# EAGLE design Reflowduino Pro v3 (EAGLE 8.4.3)
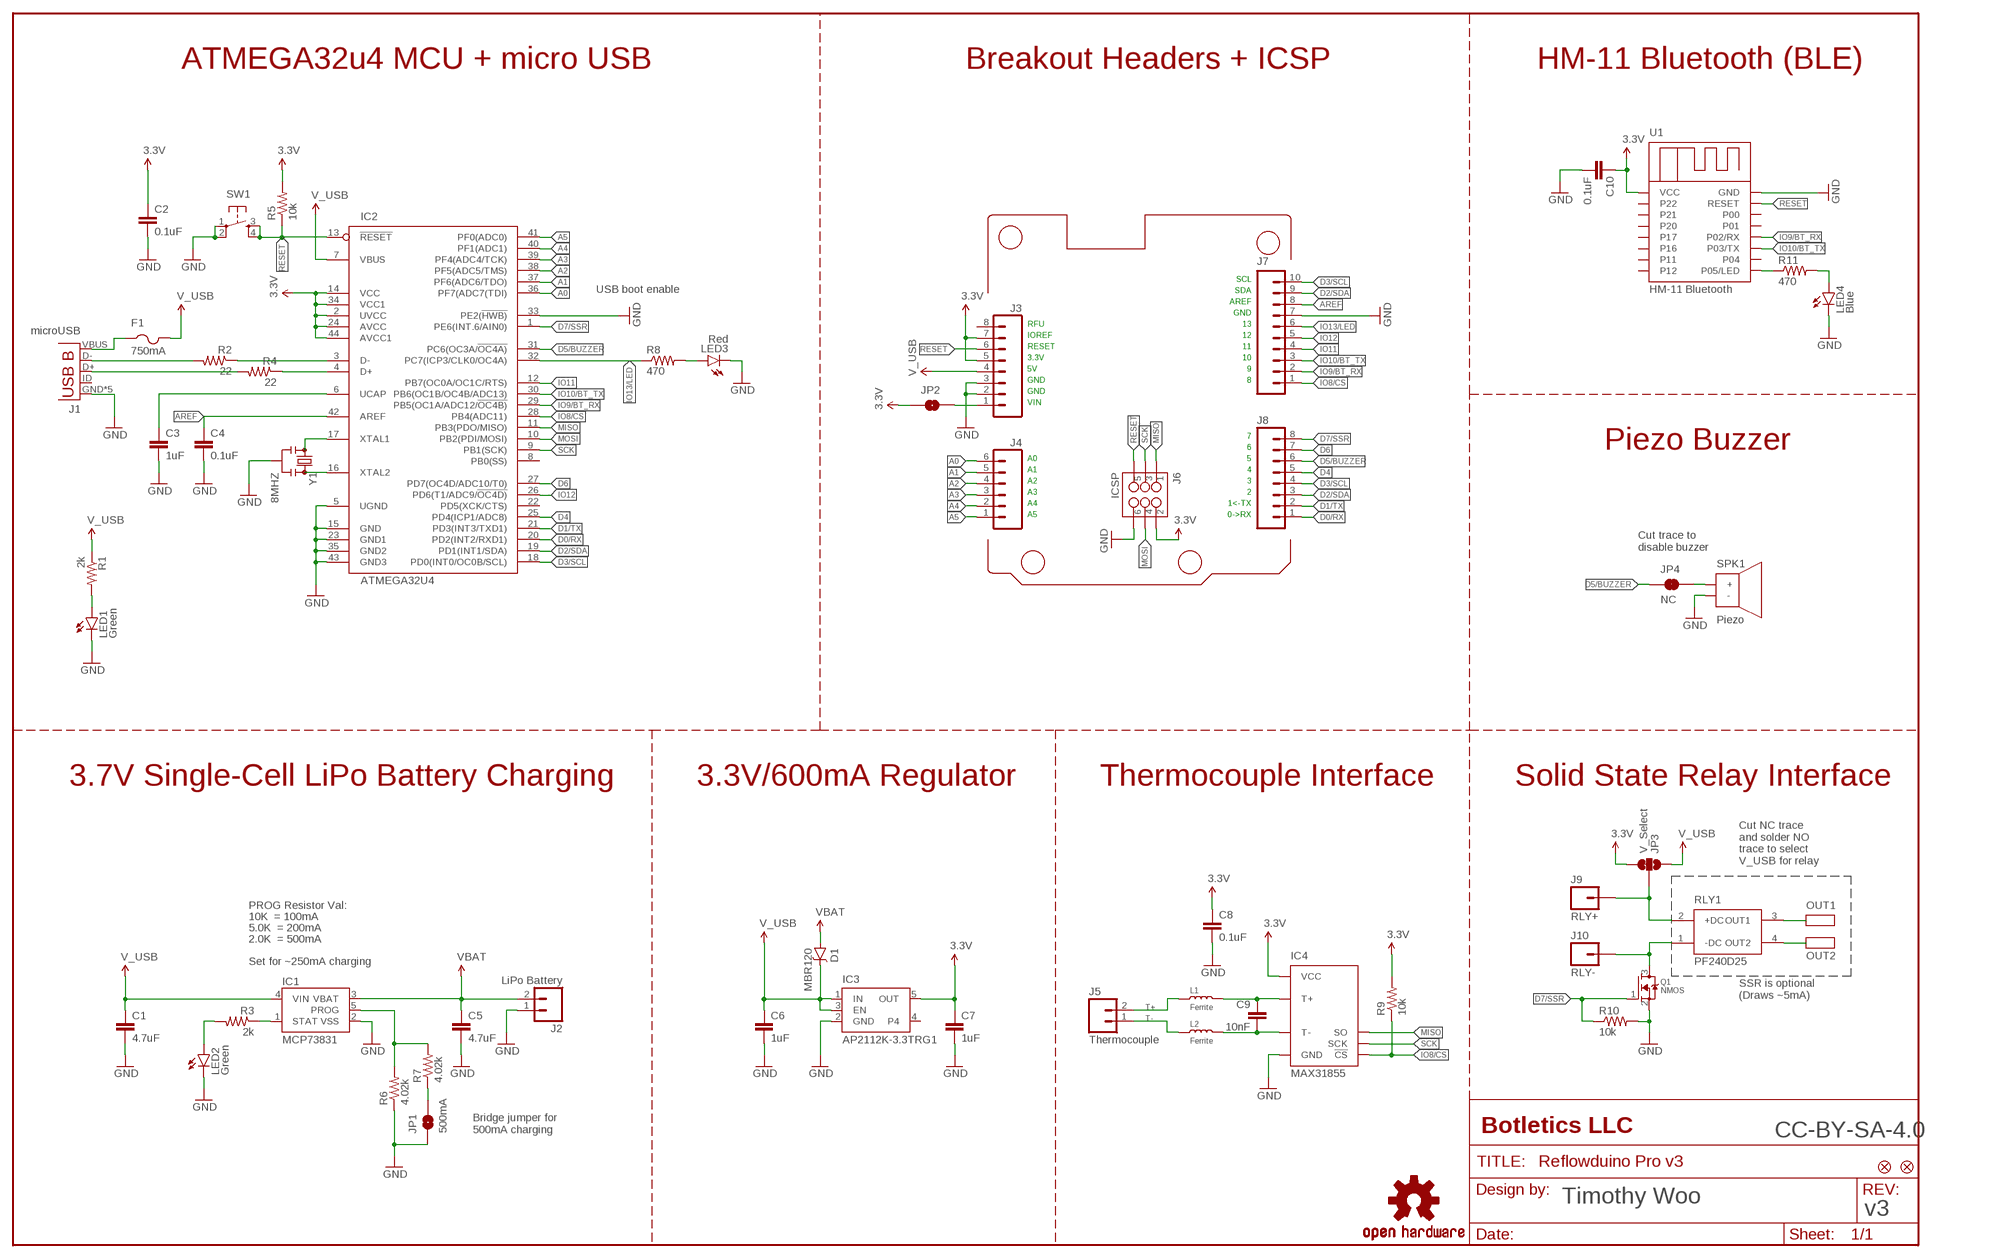
[diagram p0: schematic, sheet 1]

## Parts
C1  4.7uF  CAPMARKED-0603  [0603-CAP-MARKED]
C2  0.1uF  CAPMARKED-0603  [0603-CAP-MARKED]
C3  1uF  CAPMARKED-0603  [0603-CAP-MARKED]
C4  0.1uF  CAPMARKED-0603  [0603-CAP-MARKED]
C5  4.7uF  CAPMARKED-0603  [0603-CAP-MARKED]
C6  1uF  CAPMARKED-0603  [0603-CAP-MARKED]
C7  1uF  CAPMARKED-0603  [0603-CAP-MARKED]
C8  0.1uF  CAPMARKED-0603  [0603-CAP-MARKED]
C9  10nF  CAPMARKED-0603  [0603-CAP-MARKED]
C10  0.1uF  CAPMARKED-0603  [0603-CAP-MARKED]
D1  MBR120  DIODE-SCHOTTKYSOD-123FL  [SOD-123FL]
F1  750mA  PTCFUSE-0ZCH0075FF2G  [1210]
FID1  FIDUCIAL  [FIDUCIAL_1MM]
FID2  FIDUCIAL  [FIDUCIAL_1MM]
IC1  MCP73831  [SOT23-5]
IC2  ATMEGA32U4  ATMEGA32U4-AU  [TQFP44]
IC3  AP2112K-3.3TRG1  VOLTAGE-REGULATOR_SOT23-5SOT-23-5  [SOT23-5]
IC4  MAX31855  [MAX31855_SOIC8]
J1  microUSB  MICRO-USB_SMD_NOSHIELDV1  [USB-B-MICRO-SMD]
J2  LiPo Battery  M02-JST-2MM-SMT  [JST-2-SMD]
J3  M08SILK_PTH  [1X08]
J4  M06SILK_PTH  [1X06]
J5  Thermocouple  M023.5MM  [SCREWTERMINAL-3.5MM-2]
J6  ICSP  M03X22X3_SILK_MALE_PTH  [2X3]
J7  M10SILK_PTH  [1X10]
J8  M08SILK_PTH  [1X08]
J9  RLY+  M01PTH_LONGPAD  [1X01_LONGPAD]
J10  RLY-  M01PTH_LONGPAD  [1X01_LONGPAD]
JP1  500mA  JUMPER-SMT_2_NO_SILK  [SMT-JUMPER_2_NO_SILK]
JP2  JUMPER-SMT_2_NO_SILK  [SMT-JUMPER_2_NO_SILK]
JP3  V_Select  JUMPER-SMT_3_1-NC_TRACE_SILK  [SMT-JUMPER_3_1-NC_TRACE_SILK]
JP4  NC  JUMPER-SMT_2_NC_TRACE_SILK  [SMT-JUMPER_2_NC_TRACE_SILK]
L1  Ferrite  SMD-FERRITE-BEAD-2500R-50MA(0603)  [L0603]
L2  Ferrite  SMD-FERRITE-BEAD-2500R-50MA(0603)  [L0603]
LED1  Green  LED0603-MARKED  [LED-0603-MARKED]
LED2  Green  LED0603-MARKED  [LED-0603-MARKED]
LED3  Red  LED0603-MARKED  [LED-0603-MARKED]
LED4  Blue  LED0603-MARKED  [LED-0603-MARKED]
LOGO1  OSHW-LOGOL  [OSHW-LOGO-L]
Q1  NMOS  MOSFET-NGENERIC  [SOT23-3]
R1  2k  RESISTORMARKED-0603  [0603-RES-MARKED]
R2  22  RESISTORMARKED-0603  [0603-RES-MARKED]
R3  2k  RESISTORMARKED-0603  [0603-RES-MARKED]
R4  22  RESISTORMARKED-0603  [0603-RES-MARKED]
R5  10k  RESISTORMARKED-0603  [0603-RES-MARKED]
R6  4.02k  RESISTORMARKED-0603  [0603-RES-MARKED]
R7  4.02k  RESISTORMARKED-0603  [0603-RES-MARKED]
R8  470  RESISTORMARKED-0603  [0603-RES-MARKED]
R9  10k  RESISTORMARKED-0603  [0603-RES-MARKED]
R10  10k  RESISTORMARKED-0603  [0603-RES-MARKED]
R11  470  RESISTORMARKED-0603  [0603-RES-MARKED]
RLY1  PF240D25  RELAY_SSR_OPTO-ISOLATEDPF240  [RELAY_PF240]
SPK1  Piezo  BUZZERPKMCS0909E4000  [BUZZER_PKMCS0909E4000]
SW1  SWITCH_MOMENTARY_SPST_4-PINRECT  [TACTILE_SWITCH_SMD_4.6X2.8MM]
U1  HM-11 Bluetooth  HM-11_JDY-08_BLUETOOTH  [JDY-08_BLUETOOTH]
Y1  8MHZ  RESONATOR8MHZ  [CSTCE_RESONATOR_SMD]

## Nets
3.3V: C2.1 C7.1 C8.1 C10.1 IC2.2(UVCC) IC2.14(VCC) IC2.24(AVCC) IC2.34(VCC1) IC2.44(AVCC1) IC3.5(OUT) IC4.4(VCC) J3.5 J3.7 J6.2 JP2.1 JP3.3 R5.2 R9.2 U1.1(VCC)
A0: IC2.36(PF7(ADC7(TDI)) J4.6
A1: IC2.37(PF6(ADC6/TDO)) J4.5
A2: IC2.38(PF5(ADC5/TMS)) J4.4
A3: IC2.39(PF4(ADC4/TCK)) J4.3
A4: IC2.40(PF1(ADC1)) J4.2
A5: IC2.41(PF0(ADC0)) J4.1
AREF: C4.1 IC2.42(AREF) J7.8
D0/RX: IC2.20(PD2(INT2/RXD1)) J8.1
D1/TX: IC2.21(PD3(INT3/TXD1)) J8.2
D2/SDA: IC2.19(PD1(INT1/SDA)) J7.9 J8.3
D3/SCL: IC2.18(PD0(INT0/OC0B/SCL)) J7.10 J8.4
D4: IC2.25(PD4(ICP1/ADC8)) J8.5
D5/BUZZER: IC2.31(PC6(OC3A/!OC4A)) J8.6 JP4.1
D6: IC2.27(PD7(OC4D/ADC10/T0)) J8.7
D7/SSR: IC2.1(PE6(INT.6/AIN0)) J8.8 Q1.1(G) R10.1
D+: IC2.4(D+) R4.1
D-: IC2.3(D-) R2.1
DC+: J9.1 JP3.2 RLY1.2(+DC)
DC-: J10.1 Q1.3(D) RLY1.1(-DC)
GND [power]: C1.2 C2.2 C3.2 C4.2 C5.2 C6.2 C7.2 C8.2 C10.2 IC1.2(VSS) IC2.5(UGND) IC2.15(GND) IC2.23(GND1) IC2.33(PE2(!HWB)) IC2.35(GND2) IC2.43(GND3) IC3.2(GND) IC4.1(GND) J1.GND J1.SHIELD1(GND) J1.SHIELD2(GND) J1.SHIELD3(GND) J1.SHIELD4(GND) J2.1 J3.2 J3.3 J6.6 J7.7 JP1.1 LED1.C LED2.C LED3.C LED4.C Q1.2(S) R6.1 R10.2 SPK1.2(-) SW1.1 SW1.2 U1.16(GND) Y1.2
IO8/CS: IC2.28(PB4(ADC11)) IC4.6(!CS) J7.1 R9.1
IO9/BT_RX: IC2.29(PB5(OC1A/ADC12/!OC4B)) J7.2 U1.12(P02/RX)
IO10/BT_TX: IC2.30(PB6(OC1B/OC4B/ADC13)) J7.3 U1.11(P03/TX)
IO11: IC2.12(PB7(OC0A/OC1C/RTS)) J7.4
IO12: IC2.26(PD6(T1/ADC9/!OC4D)) J7.5
IO13/LED: IC2.32(PC7(ICP3/CLK0/OC4A)) J7.6 R8.1
LED: R11.1 U1.9(P05/LED)
MISO: IC2.11(PB3(PDO/MISO)) IC4.7(SO) J6.1
MOSI: IC2.10(PB2(PDI/MOSI)) J6.4
N$1: IC2.17(XTAL1) Y1.1
N$2: J1.D- R2.2
N$3: J1.D+ R4.2
N$5: JP4.2 SPK1.1(+)
N$6: LED2.A R3.2
N$7: C9.2 IC4.2(T-) L2.2
N$8: C9.1 IC4.3(T+) L1.2
N$9: LED1.A R1.2
N$10: IC2.16(XTAL2) Y1.3
N$11: LED4.A R11.2
N$12: JP1.2 R7.1
N$13: J3.1 JP2.2
N$31: LED3.A R8.2
OUT1: RLY1.3(OUT1)
OUT2: RLY1.4(OUT2)
PROG: IC1.5(PROG) R6.2 R7.2
RESET: IC2.13(!RESET) J3.6 J6.5 R5.1 SW1.3 SW1.4 U1.15(RESET)
SCK: IC2.9(PB1(SCK)) IC4.5(SCK) J6.3
STAT: IC1.1(STAT) R3.1
T+: J5.2 L1.1
T-: J5.1 L2.1
UCAP: C3.1 IC2.6(UCAP)
V_USB [power]: C1.1 C6.1 D1.C F1.2 IC1.4(VIN) IC2.7(VBUS) IC3.1(IN) IC3.3(EN) J3.4 JP3.1 R1.1
VBAT [power]: C5.1 D1.A IC1.3(VBAT) J2.2
XUSB: F1.1 J1.VBUS
Unconnected: IC2.8(PB0(SS)) IC2.22(PD5(XCK/CTS)) IC3.4 J1.ID(USBID) J3.8 U1.2(P22) U1.3(P21) U1.4(P20) U1.5(P17) U1.6(P16) U1.7(P11) U1.8(P12) U1.10(P04) U1.13(P01) U1.14(P00)

## Notes on the sheet
- ATMEGA32u4 MCU + micro USB | Breakout Headers + ICSP | HM-11 Bluetooth (BLE)
- SCL
- USB boot enable | SDA
- AREF
- GND
- RFU | 13
- IOREF | 12
- RESET | 11
- 3.3V | 10
- 5V | 9
- GND | 8
- GND
- VIN
- 7
- 6 | Piezo Buzzer
- A0 | 5
- A1 | 4
- A2 | 3
- A3 | 2
- A4 | 1<-TX
- A5 | 0->RX
- Cut trace to
  disable buzzer
- 3.7V Single-Cell LiPo Battery Charging | 3.3V/600mA Regulator | Thermocouple Interface | Solid State Relay Interface
- Cut NC trace
  and solder NO
  trace to select
  V_USB for relay
- PROG Resistor Val: | OUT1
- 10K  = 100mA
- 5.0K  = 200mA
- 2.0K  = 500mA
- OUT2
- Set for ~250mA charging
- SSR is optional
  (Draws ~5mA)
- Bridge jumper for
  500mA charging
- CC-BY-SA-4.0
- Timothy Woo
- v3

## Library data of the parts
C1-C10 = TimWoo-Capacitors:CAP: Capacitor Standard 0603 ceramic capacitor, and 0.1" leaded capacitor.
D1 = TimWoo-Diodes:DIODE-SCHOTTKY: Schottky diodes in SFE's production catalog BAT20J 1A 23V 0.62Vf RB751 120mA 40V 0.37Vf PMEG4005EJ 0.5A 40V 0.42Vf MBRA140 1A 40V 0.5Vf B340A 3A 40V SMA
F1 = TimWoo-PTC_Fuses:PTCFUSE: PTC fuses, resettable thermistors
FID1 FID2 = TimWoo-Aesthetics:FIDUCIAL: Fiducial Alignment Points Various fiducial points for machine vision alignment.
IC1 = TimWoo-IC:MCP73831: Miniature single cell, fully integrated Li-Ion, Li-polymer charge management controller http://ww1.microchip.com/downloads/en/DeviceDoc/20001984g.pdf IC-09995; PROD_ID: IC-09995
IC2 = TimWoo-IC:ATMEGA32U4: http://www.ladyada.net/library/eagle
IC3 = TimWoo-IC:VOLTAGE-REGULATOR_SOT23-5: SOT23-5 Fixed Voltage Regulators To better organise some of the SOT23-5 fixed voltage regulators in this library, this new part was created. Part Current Out V Out V In V Dropout Digikey Part No. ADP121 150mA 3.3V 3.4-5.5V 0.09V @ 150mA ADP121-AUJZ33R7CT-ND ADP121 150mA 3.0V 3.1-5.5V 0.09V @ 150mA ADP121-AUJZ30R7CT-ND ADP122 300mA 3.3V 3.4-5.5V 0.085V @ 300mA ADP122AUJZ-3.3-R7CT-ND ADP1712 300mA 3.3V 3.5-5.5V 0.17V @ 300mA ADP1712AUJZ-3.3-R7TR-ND AP7311 (Low Cost) 150mA 3.3V 3.5-6V 0.15V @ 150mA AP7311-33WG-7DICT-ND LD39015M18R 150mA 1.8V 1.9V-5.5V 0.08V @ 100mA 497-6977-1-ND MCP1824T-3302E/OT 300mA 3.3V 3.5V-6V 0.2V @ 300mA MCP1824T-3302E/OTCT-ND MIC5205-2.5YM5 TR 150mA 2.5V 2.7-16V 0.165V @ 150mA 576-1257-2-ND MIC5205-3.0YM5 TR 150mA 3.0V 3.2V-16V 0.165V @ 150mA 576-1258-2-ND MIC5205-3.3YM5 TR 150mA 3.3V 3.5V-16V 0.165V @ 150mA 576-1259-2-ND TPS780330220 150mA 3.3V+2.2V 3.6-5.5V 250mV Max 296-23332-1-ND TDA3663/N1,135 100mA 3.3V 3.5-45V 0.18V @ 50mA 568-5343-1-ND
IC4 = TimWoo-IC:MAX31855
J1 = TimWoo-Connectors:MICRO-USB_SMD_NOSHIELD
J2 = TimWoo-Connectors:M02: Standard 2-pin 0.1" header. Use with - straight break away headers ( PRT-00116) - right angle break away headers (PRT-00553) - swiss pins (PRT-00743) - machine pins (PRT-00117) - female headers (PRT-00115) Molex polarized connector foot print use with: PRT-08233 with associated crimp pins and housings. 2.54_SCREWTERM for use with PRT-10571. 3.5mm Screw Terminal footprints for PRT-08084 5mm Screw Terminal footprints for use with PRT-08432; PROD_ID: CONN-11443
J3 J8 = TimWoo-Connectors:M08: Header 8 Standard 8-pin 0.1" header. Use with straight break away headers (SKU : PRT-00116), right angle break away headers (PRT-00553), swiss pins (PRT-00743), machine pins (PRT-00117), and female headers (PRT-00115).; PROD_ID: CONN-08438
J4 = TimWoo-Connectors:M06: Header 6 Standard 6-pin 0.1" header. Use with straight break away headers (SKU : PRT-00116), right angle break away headers (PRT-00553), swiss pins (PRT-00743), machine pins (PRT-00117), and female headers (PRT-00115). Molex polarized connector foot print use with SKU : PRT-08094 with associated crimp pins and housings. NOTES ON THE VARIANTS LOCK and LOCK_LONGPADS... This footprint was designed to help hold the alignment of a through-hole component (i.e. 6-pin header) while soldering it into place. You may notice that each hole has been shifted either up or down by 0.005 of an inch from it's more standard position (which is a perfectly straight line). This slight alteration caused the pins (the squares in the middle) to touch the edges of the holes. Because they are alternating, it causes a "brace" to hold the component in place. 0.005 has proven to be the perfect amount of "off-center" position when using our standard breakaway headers. Although looks a little odd when you look at the bare footprint, once you have a header in there, the alteration is very hard to notice. Also,if you push a header all the way into place, it is covered up entirely on the bottom side. This idea of altering the position of holes to aid alignment will be further integrated into the Sparkfun Library for other footprints. It can help hold any component with 3 or more connection pins.; PROD_ID: CONN-08437
J5 = TimWoo-Connectors:M02: Standard 2-pin 0.1" header. Use with - straight break away headers ( PRT-00116) - right angle break away headers (PRT-00553) - swiss pins (PRT-00743) - machine pins (PRT-00117) - female headers (PRT-00115) Molex polarized connector foot print use with: PRT-08233 with associated crimp pins and housings. 2.54_SCREWTERM for use with PRT-10571. 3.5mm Screw Terminal footprints for PRT-08084 5mm Screw Terminal footprints for use with PRT-08432; PROD_ID: CONN-08399
J6 = TimWoo-Connectors:M03X2: 2x3 .1" header. Shrouded, with keying- CONN-10681 SMT- CONN-11415 Pogo pins- HW-11044; PROD_ID: CONN-09701
J7 = TimWoo-Connectors:M10: Header 10 Standard 10-pin 0.1" header. Use with straight break away headers (SKU : PRT-00116), right angle break away headers (PRT-00553), swiss pins (PRT-00743), machine pins (PRT-00117), and female headers (PRT-00115).; PROD_ID: CONN-11563
J9 J10 = TimWoo-Connectors:M01: Header 1 Standard 1-pin 0.1" header. Use with straight break away headers (SKU : PRT-00116), right angle break away headers (PRT-00553), swiss pins (PRT-00743), machine pins (PRT-00117), and female headers (PRT-00115). SMTSO-256-ET is a "flush mount" nut for a 4-40 screw. The older package used to be too tight, and did not allow it to sit properly thru the drill hit. The latest (0.165DIA) fits nice and snug.
JP1 JP2 = TimWoo-Connectors:JUMPER-SMT_2_NO: Normally open jumper This jumper has two pads in close proximity to each other. Apply solder to close the connection. Round pads are easier to solder for beginners, but are a lot larger. SparkFun Product that uses the round pads: SparkFun EL Sequencer <https://www.sparkfun.com/products/12781>
JP3 = TimWoo-Connectors:JUMPER-SMT_3_1-NC_TRACE: Normally closed trace jumper (1 of 2 connections) This jumper has a trace between two pads so it's normally closed (NC). The other connection is normally open (NO). Use a razor knife to open the connection. For best results follow the IPC guidelines for cutting traces: Cutout at least 0.063 mm (0.005 in). Remove all loose material to clean up the cut area. Seal the cut with an approved epoxy. Reapply solder to reclose the connection, or to close the NO connection.
JP4 = TimWoo-Connectors:JUMPER-SMT_2_NC_TRACE: Normally closed trace jumper This jumper has a trace between two pads so it's normally closed (NC). Use a razor knife to open the connection. For best results follow the IPC guidelines for cutting traces: Cutout at least 0.063 mm (0.005 in). Remove all loose material to clean up the cut area. Seal the cut with an approved epoxy. Reapply solder to reclose the connection.
L1 L2 = TimWoo-Inductors:SMD-FERRITE-BEAD-2500R-50MA(0603): 303030020; VALUE: 2500R-50MA
LED1-LED4 = TimWoo-LED:LED: LEDs Standard schematic elements and footprints for 5mm, 3mm, 1206, and 0603 sized LEDs. 5mm - Spark Fun Electronics SKU : COM-00529 (and others)
LOGO1 = SparkFun-Aesthetics:OSHW-LOGO: Open-Source Hardware (OSHW) Logo This logo indicates the piece of hardware it is found on incorporates a OSHW license and/or adheres to the definition of open source hardware found here: http://freedomdefined.org/OSHW
Q1 = TimWoo-MOSFETs:MOSFET-N: N-Channel Mosfet DMG2302UK - 20V 2.8A SOT23 [Digikey: DMG2302UK-7DICT-ND] 2N7002E - 60V 260mA SOT23 [Digikey: 2N7002ET1GOSTR-ND] - REEL BSH103 - 30V 850mA SOT23 [Digikey: 568-5013-1-ND]
R1-R11 = TimWoo-Resistors:RESISTOR: Resistor Basic schematic elements and footprints for 0603, 1206, and PTH resistors.
RLY1 = TimWoo-Electromechanical:RELAY_SSR_OPTO-ISOLATED
SPK1 = TimWoo-Electromechanical:BUZZER
SW1 = TimWoo-Electromechanical:SWITCH_MOMENTARY_SPST_4-PIN; PROD_ID: SWCH-13065
U1 = TimWoo-RF:HM-11_JDY-08_BLUETOOTH
Y1 = TimWoo-FreqControl:RESONATOR: Resonator Small SMD resonator. Used, eg, on the Arduino Pro/ Pro Mini boards. 8MHz- XTAL-08895 16MHz- XTAL-08900

## Net classes
0 default: width 0.305 mm
1 power: width 0.406 mm

## Board
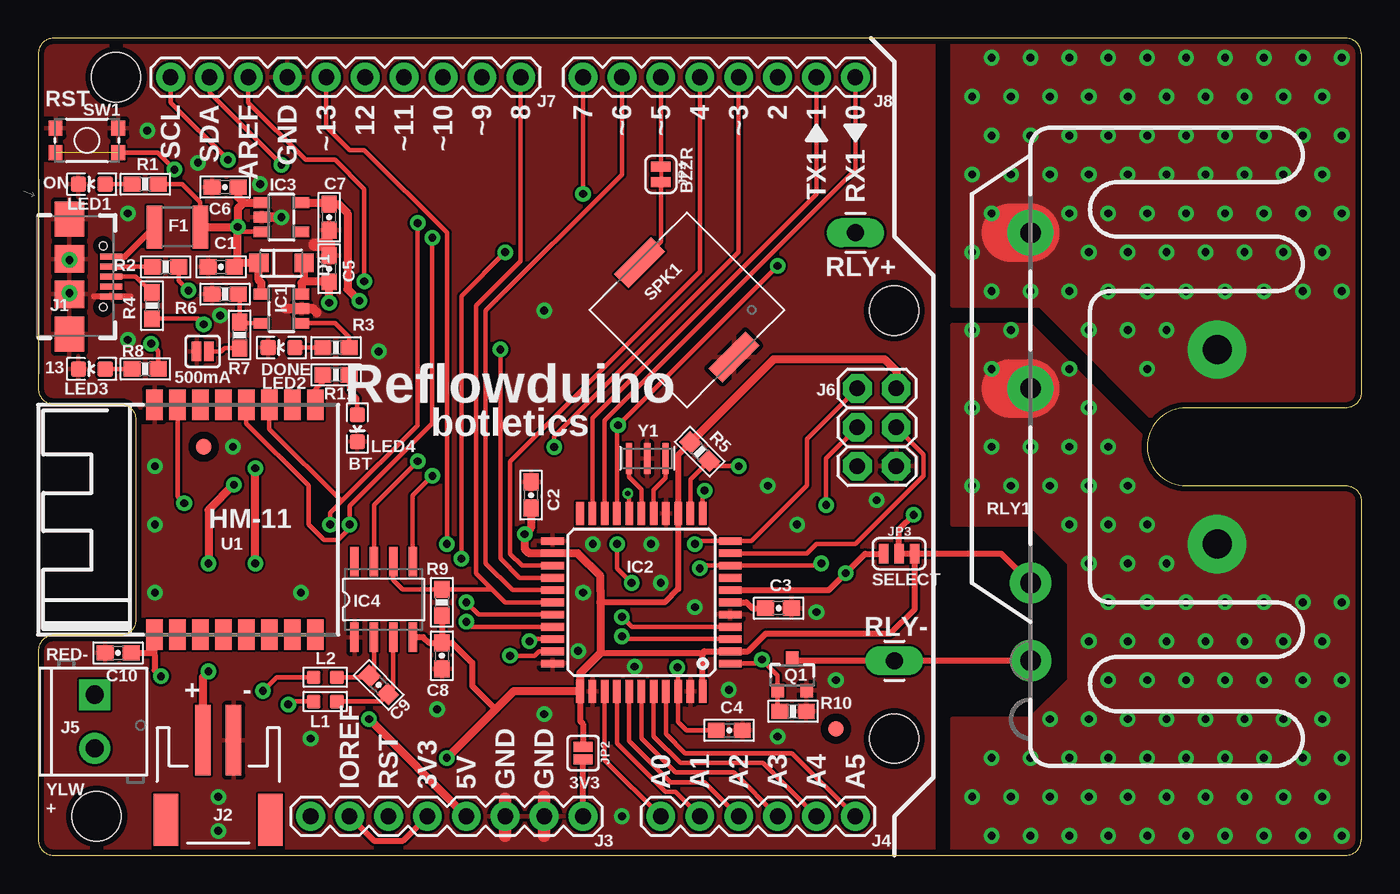
[diagram p1: board, top side]
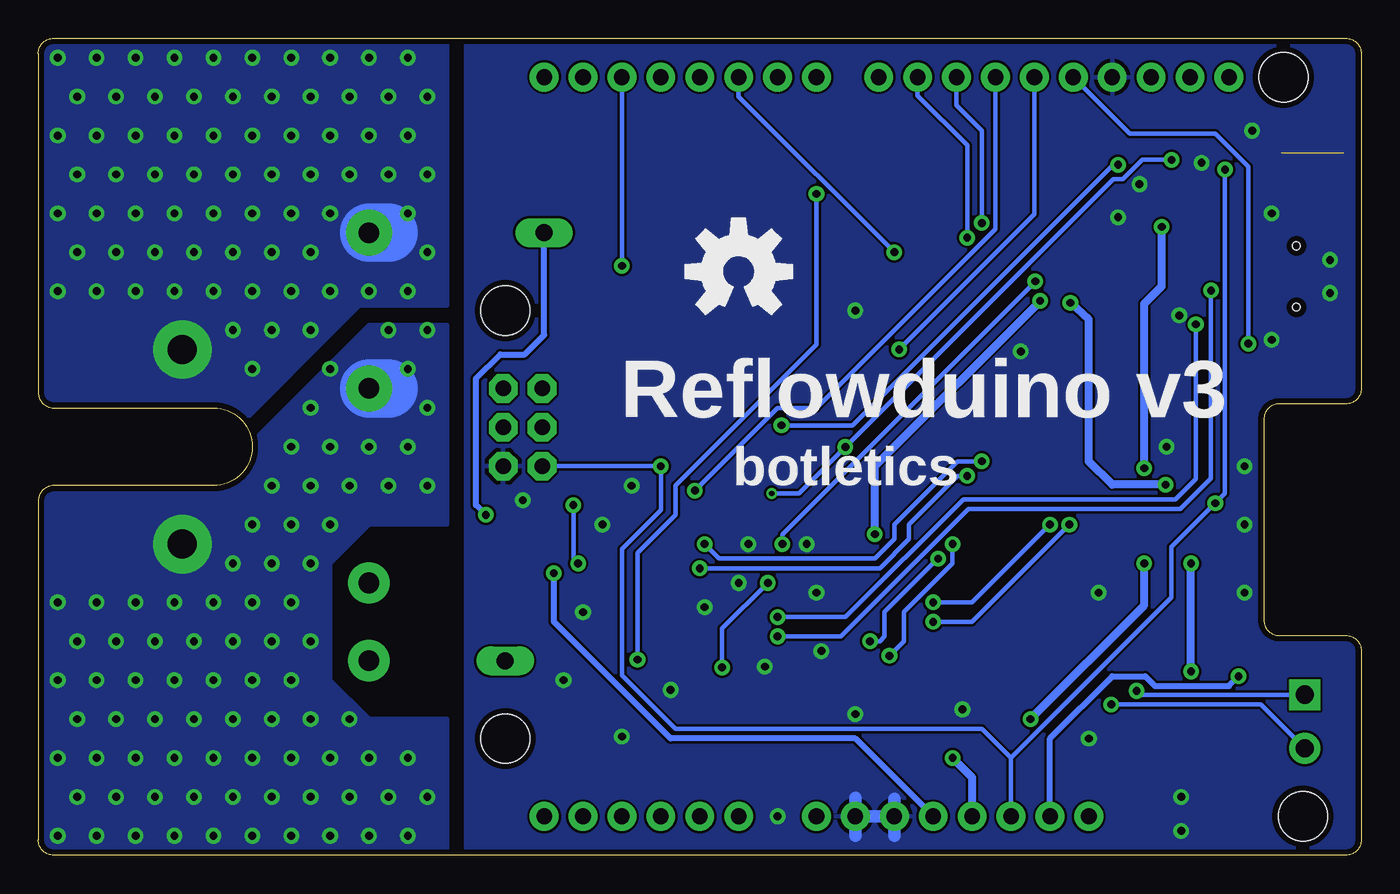
[diagram p2: board, bottom side, seen from below]

Size 86.36 x 53.34 mm. Coordinates in mm from the lower left corner, seen from the top.
Outline: 0,52.34 0,30.46 arc90 1,29.46 5.35,29.46 arc-90 6.35,28.46 6.35,15.35 arc-90 5.35,14.35 1,14.35 arc90 0,13.35 0,1 arc90 1,0 85.36,0 arc90 86.36,1 86.36,23.13 arc90 85.36,24.13 74.93,24.13 arc-90 72.39,26.67 arc-90 74.93,29.21 85.36,29.21 arc90 86.36,30.21 86.36,52.34 arc90 85.36,53.34 1,53.34 arc90 0,52.34
Copper layers (1*16): Top 0.0356mm / dielectric 1.5011mm / Bottom 0.0356mm
Design rules "oshpark-2layer *": minimum track width 6mil, minimum drill 13mil, track to track 6mil, track to pad 6mil, pad to pad 6mil, via to via 6mil, smd to smd 6mil, copper to edge 15mil, drill to drill 6mil, minimum pad ring 7mil, minimum via ring 7mil, stop-mask expansion 2.5mil, vias tented up to drill 0mil, thermal gap 10mil
Holes 3.2 mm at 5.08,50.8 3.81,2.54 55.88,35.56 55.88,7.62

### Footprints (pad centres in the part's own frame; a part is rotated, then mirrored left to right if it is on the bottom)
0603-CAP-MARKED = smd 1.1 x 1: 1 -0.85,0; 2 0.85,0
SOD-123FL = smd 1.25 x 1.22: A 1.475,0; C -1.475,0
1210 = smd 1 x 2.8: 1 -1.5,0; 2 1.5,0
FIDUCIAL_1MM = smd 1 x 1: 1 0,0
SOT23-5 = smd 0.7 x 1: 1 -0.95,-1.3; 2 0,-1.3; 3 0.95,-1.3; 4 0.95,1.3; 5 -0.95,1.3
TQFP44 = smd 1.5 x 0.5: 1 -5.8,4; 2 -5.8,3.2; 3 -5.8,2.4; 4 -5.8,1.6; 5 -5.8,0.8; 6 -5.8,0; 7 -5.8,-0.8; 8 -5.8,-1.6; 9 -5.8,-2.4; 10 -5.8,-3.2; 11 -5.8,-4; 23 5.8,-4; 24 5.8,-3.2; 25 5.8,-2.4; 26 5.8,-1.6; 27 5.8,-0.8; 28 5.8,0; 29 5.8,0.8; 30 5.8,1.6; 31 5.8,2.4; 32 5.8,3.2; 33 5.8,4 | smd 0.5 x 1.5: 12 -4,-5.8; 13 -3.2,-5.8; 14 -2.4,-5.8; 15 -1.6,-5.8; 16 -0.8,-5.8; 17 0,-5.8; 18 0.8,-5.8; 19 1.6,-5.8; 20 2.4,-5.8; 21 3.2,-5.8; 22 4,-5.8; 34 4,5.8; 35 3.2,5.8; 36 2.4,5.8; 37 1.6,5.8; 38 0.8,5.8; 39 0,5.8; 40 -0.8,5.8; 41 -1.6,5.8; 42 -2.4,5.8; 43 -3.2,5.8; 44 -4,5.8
MAX31855_SOIC8 = smd 0.53 x 1.92: 1 -1.905,-2.465; 2 -0.635,-2.465; 3 0.635,-2.465; 4 1.905,-2.465; 5 1.905,2.465; 6 0.635,2.465; 7 -0.635,2.465; 8 -1.905,2.465
USB-B-MICRO-SMD = smd 1.45 x 0.4: D+ 2.725,0; D- 2.725,0.65; GND 2.725,-1.3; ID 2.725,-0.65; VBUS 2.725,1.3 | smd 1.9 x 2.3: SHIELD1 0,3.75; SHIELD2 0,-3.75 | smd 1.9 x 1.8: SHIELD3 0,1.15; SHIELD4 0,-1.15 | hole 0.5: 2.2,2; 2.2,-2
JST-2-SMD = smd 1 x 4.6: 1 -1,-3.7; 2 1,-3.7 | smd 1.6 x 3.4: NC1 -3.4,1.5; NC2 3.4,1.5
1X08 = drill 1.016 pad 1.88: 1 -8.89,0; 2 -6.35,0; 3 -3.81,0; 4 -1.27,0; 5 1.27,0; 6 3.81,0; 7 6.35,0; 8 8.89,0
1X06 = drill 1.016 pad 1.88: 1 -6.35,0; 2 -3.81,0; 3 -1.27,0; 4 1.27,0; 5 3.81,0; 6 6.35,0
SCREWTERMINAL-3.5MM-2 = drill 1.2 pad 2.032 square: 1 0,0 | drill 1.2 pad 2.032: 2 3.5,0
2X3 = drill 1.016 pad 1.88 octagon: 1 -2.54,-1.27; 2 -2.54,1.27; 3 0,-1.27; 4 0,1.27; 5 2.54,-1.27; 6 2.54,1.27
1X10 = drill 1.016 pad 1.88: 1 -11.43,0; 2 -8.89,0; 3 -6.35,0; 4 -3.81,0; 5 -1.27,0; 6 1.27,0; 7 3.81,0; 8 6.35,0; 9 8.89,0; 10 11.43,0
1X01_LONGPAD = drill 1.118 pad 1.88 long: 1 0,0
SMT-JUMPER_2_NO_SILK = smd 0.635 x 1.27: 1 -0.406,0; 2 0.406,0
SMT-JUMPER_3_1-NC_TRACE_SILK = smd 0.635 x 1.27: 1 -1.016,0; 2 0,0; 3 1.016,0
SMT-JUMPER_2_NC_TRACE_SILK = smd 0.635 x 1.27: 1 -0.508,0; 2 0.508,0
L0603 = smd 0.889 x 0.889: 1 -0.762,0; 2 0.762,0
LED-0603-MARKED = smd 1 x 1: A -0.877,0; C 0.877,0
SOT23-3 = smd 0.8 x 0.9: 1 -0.95,-1; 2 0.95,-1; 3 0,1.1
0603-RES-MARKED = smd 1.1 x 1: 1 -0.85,0; 2 0.85,0
RELAY_PF240 = drill 1.35 pad 2.7: 1 13.97,0; 2 8.89,0 | drill 1.35 pad 3: 3 -3.81,0; 4 -13.97,0
BUZZER_PKMCS0909E4000 = smd 1.3 x 3.4: 1 -4.35,0; 2 4.35,0
TACTILE_SWITCH_SMD_4.6X2.8MM = smd 0.9 x 1: 1 -2.05,-0.8; 2 2.05,-0.8; 3 2.05,0.8; 4 -2.05,0.8
JDY-08_BLUETOOTH = smd 2 x 1.1: 1 -7.5,5.75; 2 -7.5,4.25; 3 -7.5,2.75; 4 -7.5,1.25; 5 -7.5,-0.25; 6 -7.5,-1.75; 7 -7.5,-3.25; 8 -7.5,-4.75; 9 7.5,-4.75; 10 7.5,-3.25; 11 7.5,-1.75; 12 7.5,-0.25; 13 7.5,1.25; 14 7.5,2.75; 15 7.5,4.25; 16 7.5,5.75
CSTCE_RESONATOR_SMD = smd 0.4 x 2: 1 -1.2,0; 2 0,0; 3 1.2,0

### Placement (x,y rotation side)
C1  11.94,38.42 180 top
C2  32.17,23.51 90 top
C3  48.32,16.13 0 top
C4  45.1,8.16 0 top
C5  18.99,38.29 90 top
C6  12.19,43.62 180 top
C7  18.99,41.66 270 top
C8  26.35,13.02 270 top
C9  22.23,11.11 135 top
C10  5.21,13.21 180 top
D1  15.88,38.67 0 top
F1  9.08,41.02 0 top
FID1  10.79,26.67 270 top
FID2  52.07,8.26 270 top
IC1  15.88,35.69 90 top
IC2  39.37,16.51 180 top
IC3  15.88,41.66 270 top
IC4  22.54,16.7 0 top
J1  2.03,37.78 0 top
J2  11.75,3.81 180 top
J3  26.67,2.54 180 top
J4  46.99,2.54 180 top
J5  3.68,10.48 270 top
J6  54.74,27.94 270 top
J7  20.07,50.8 180 top
J8  44.45,50.8 180 top
J9  53.34,40.64 90 top
J10  55.88,12.7 90 top
JP1  10.73,32.89 0 top
JP2  35.56,6.67 270 top
JP3  56.2,19.68 0 top
JP4  40.64,44.45 270 top
L1  18.73,10.03 0 top
L2  18.73,11.62 0 top
LED1  3.49,43.81 180 top
LED2  15.88,33.15 180 top
LED3  3.49,31.75 180 top
LED4  20.83,27.88 270 top
LOGO1  40.64,38.1 0 bottom
Q1  49.21,11.75 0 top
R1  6.99,43.81 180 top
R2  8.32,38.42 180 top
R3  19.43,33.15 180 top
R4  7.43,35.88 90 top
R5  43.18,26.35 135 top
R6  12.19,36.64 0 top
R7  13.14,33.97 90 top
R8  6.99,31.75 180 top
R9  26.35,16.51 270 top
R10  49.28,9.4 0 top
R11  19.43,31.37 0 top
RLY1  64.77,26.67 270 top
SPK1  42.33,35.61 315 top
SW1  3.17,46.67 180 top
U1  13.34,21.91 90 top
Y1  39.75,25.91 0 top

### Tracks (layer width: path | path; a pad name or v marks a point on that pad's centre or on a via)
3.3V  (via drill 0.51 pad 1.02)
  Top 0.406: 36.7,13.21 43.27,13.21 | 43.27,13.21 43.37,13.21 43.47,13.31 IC2.2 46.33,13.31 47.5,14.48 55.63,14.48 57.21,16.07 JP3.3 | J3.7 21.91,0.95 23.81,0.95 J3.5 | R5.2 41.77,26.14 IC2.14 41.77,17.38 40.9,16.51 36.7,16.51 | IC2.44 43.37,13.1 43.27,13.21 | 36.71,17.31 36.7,17.32 | IC2.34 35.37,8.76 35.56,8.57 JP2.1 | C8.1 25.5,13.87 25.13,14.24 IC4.4 | R9.2 C8.1 | v8,11.68 7.58,12.1 7.58,13.08 | 7.58,13.08 U1.1 | C10.1 7.46,13.21 7.58,13.08 | C8.1 27.03,13.87 28.32,12.57 28.32,11.05 29.84,9.53
  Top 0.508: R5.2 48.01,32.38 55.24,32.38 56.01,31.62 J6.2 | C2.1 32.17,21.37 v31.75,20.95 31.75,20 32.04,19.71 IC2.24 35.22,19.71 36.7,18.23 36.7,17.32 36.7,16.51 36.7,13.21 35.37,11.88 IC2.34 31.03,10.71 29.84,9.53 v26.67,6.35 | v20.95,36.2 20.19,36.96 20.19,41.91 19.6,42.51 C7.1 18.76,42.61 IC3.5
  Bottom 0.406: J3.7 20.32,7.62 16.26,11.68 14.1,11.68 13.46,11.05 8.64,11.05 v8,11.68
  Bottom 0.508: v31.75,20.95 31.75,25.4 v20.95,36.2 | v26.67,6.35 25.4,5.08 J3.5
A0
  Top 0.305: IC2.36 36.97,6.21 J4.6
A1
  Top 0.305: IC2.37 37.77,7.32 40.96,4.13 41.59,4.13 J4.5
A2
  Top 0.305: J4.4 43.5,4.76 41.27,4.76 38.57,7.47 IC2.38
A3
  Top 0.305: J4.3 45.4,5.4 41.59,5.4 39.37,7.62 IC2.39
A4
  Top 0.305: J4.2 47.31,6.03 41.91,6.03 40.17,7.77 IC2.40
A5
  Top 0.305: J4.1 49.21,6.67 42.23,6.67 40.97,7.92 IC2.41
AREF  (via drill 0.51 pad 1.02)
  Top 0.305: C4.1 42.33,8.15 41.77,8.71 IC2.42 41.77,12.21 v41.72,12.26 | v21.27,37.47 21.27,43.5 19.37,45.4 17.46,45.4 13.72,49.15 J7.8 | v38.73,17.78 37.78,18.73 v37.78,20.32
  Bottom 0.305: v38.73,17.78 41.72,14.8 v41.72,12.26 | v37.78,20.32 37.78,20.95 v21.27,37.47
D0/RX
  Top 0.305: IC2.20 36.97,28.4 53.34,44.77 J8.1
D1/TX
  Top 0.305: IC2.21 36.17,28.55 50.8,43.18 J8.2
D2/SDA  (via drill 0.51 pad 1.02)
  Top 0.305: IC2.19 37.77,27.99 v37.85,28.07 v48.26,38.48 | J7.9 11.18,49.78 v15.88,45.09
  Bottom 0.305: v48.26,38.48 J8.3 | v37.85,28.07 33.21,28.07 16.19,45.09 v15.88,45.09
D3/SCL  (via drill 0.35, 0.51 pad 1.02)
  Top 0.305: IC2.18 38.57,23.53 v38.48,23.62 | J8.4 45.72,39.37 33.67,27.32 v33.67,26.65 | J7.10 8.64,49.15 v12.38,45.4
  Bottom 0.305: v38.48,23.62 36.7,23.62 v33.67,26.65 16.19,44.13 15.56,44.13 14.29,45.4 v12.38,45.4
D4
  Top 0.305: IC2.25 31.57,18.91 30.8,19.68 30.8,25.72 43.18,38.1 J8.5
D5/BUZZER  (via drill 0.51 pad 1.02)
  Top 0.305: IC2.31 32.21,14.11 v32.07,13.97 | v27.62,19.37 27.62,36.51 v30.48,39.37 | J8.6 JP4.1
  Bottom 0.305: v30.48,39.37 40.64,49.53 J8.6 | v32.07,13.97 31.43,13.97 31.11,14.29 31.11,15.88 v27.62,19.37
D6
  Top 0.305: IC2.27 30.95,17.31 29.21,19.05 29.21,35.56 38.1,44.45 J8.7
D7/SSR  (via drill 0.51 pad 1.02)
  Top 0.305: IC2.1 46.99,12.51 v47.24,12.76 48.26,11.74 Q1.1 48.26,9.56 R10.1 | v35.56,43.18 J8.8
  Bottom 0.305: v35.56,43.18 35.56,33.34 44.77,24.13 44.77,22.23 47.24,19.75 v47.24,12.76
D+  (via drill 0.51 pad 1.02)
  Top 0.305: IC2.4 38.75,14.91 v38.1,15.56 | R4.1 10.44,35.03 v10.79,34.67
  Bottom 0.305: v38.1,15.56 33.66,15.56 25.97,23.24 12.13,23.24 10.79,24.57 v10.79,34.67
D-  (via drill 0.51 pad 1.02)
  Top 0.305: IC2.3 38.28,14.11 v38.1,14.29 | R2.1 9.17,37.5 v9.8,36.87
  Bottom 0.305: v38.1,14.29 33.97,14.29 25.65,22.61 11.81,22.61 9.8,24.61 v9.8,36.87
DC+  (via drill 0.51 pad 1.02)
  Top 0.406: RLY1.2 62.87,19.68 JP3.2 56.2,21.27 v57.15,22.23
  Bottom 0.406: v57.15,22.23 57.78,22.86 57.78,31.11 56.2,32.7 54.61,32.7 53.34,33.97 J9.1
DC-
  Top 0.406: RLY1.1 J10.1 49.36,12.7 Q1.3
GND  (via drill 0.51 pad 1.02)
  Top 0.406: 6,36.48 J1.GND 3.65,36.48
  Top 0.61: 16.13,35.69 IC1.2 17.91,35.69 18.16,35.43 | 15.75,41.66 IC3.2
  Top 0.813: 30.48,3.68 J3.3 30.48,1.27 | 33.02,3.81 J3.2 33.02,1.27 | C5.2 18.99,39.88 18.03,39.88
  Bottom 0.813: J3.3 J3.2 | J3.3 30.48,3.68 | J3.3 30.48,1.27 | J3.2 33.02,3.75 | J3.2 33.02,1.27
  other vias: 42.86,16.19 7.62,17.14 2.03,38.86 5.84,33.66 5.84,41.91 52.07,11.43 54.74,23.18 49.53,21.59 47.62,24.13 33.02,35.56 7.62,21.59 7.62,25.4 11.87,35.24 7.11,47.31 12.7,26.67 11.75,3.81 11.75,1.59 26.04,9.53 33.02,9.21 38.1,2.54 48.26,7.75 50.8,15.88 40.01,20.32 36.2,20.32 35.56,17.14 35.24,13.34 40.64,17.78 38.93,12.32 10.41,45.21 17.14,17.14 17.78,7.62 14.48,43.81 15.88,41.66 22.23,32.89 45.09,10.79 2.03,36.7
  pour Top: -1.27,54.61 58.42,54.61 58.42,-1.27 -1.27,-1.27
  pour Bottom: -2.54,55.88 58.42,55.88 58.42,-2.54 -2.54,-2.54
IO8/CS
  Top 0.305: J7.1 31.5,38.8 28.57,35.88 28.57,18.41 29.61,17.38 | IC2.28 30.48,16.51 29.61,17.38 | 29.61,17.38 29.58,17.36 R9.1 23.79,17.36 23.18,17.97 IC4.6
IO9/BT_RX  (via drill 0.51 pad 1.02)
  Top 0.305: IC2.29 28.74,15.71 v27.94,16.51 | v25.72,40.32 25.72,28.19 20.32,22.8 v20.32,21.59 20.32,21.34 19.56,20.57 18.67,20.57 17.65,21.59 17.65,24.13 13.59,28.2 U1.12
  Bottom 0.305: J7.2 28.96,49.59 25.72,46.35 v25.72,40.32 | v20.32,21.59 25.4,16.51 v27.94,16.51
IO10/BT_TX  (via drill 0.51 pad 1.02)
  Top 0.305: IC2.30 28.27,14.91 v27.94,15.24 | v24.77,41.27 24.77,28.07 19.81,23.11 | 19.81,23.11 19.3,22.61 19.18,22.48 19.05,22.35 v19.05,21.59 | U1.11 15.09,27.84 19.81,23.11
  Bottom 0.305: J7.3 26.42,48.96 24.77,47.31 v24.77,41.27 | v19.05,21.59 25.4,15.24 v27.94,15.24
IO11  (via drill 0.51 pad 1.02)
  Top 0.305: v43.5,23.81 43.37,23.68 IC2.12
  Bottom 0.305: v43.5,23.81 38.1,29.21 35.56,29.21 23.88,40.89 J7.4
IO12  (via drill 0.51 pad 1.02)
  Top 0.305: IC2.26 31.42,18.11 30.16,19.37 v30.16,33.02
  Bottom 0.305: v30.16,33.02 21.34,41.85 J7.5
IO13/LED  (via drill 0.51 pad 1.02)
  Top 0.305: IC2.32 32.68,13.31 32.38,13.02 v30.8,13.02 | v26.67,20.32 26.67,40.64 21.27,46.04 20.32,46.04 18.8,47.56 J7.6 | R8.1 7.83,32.93 v7.37,33.4
  Bottom 0.305: v26.67,20.32 26.67,19.05 29.84,15.88 29.84,13.97 v30.8,13.02 | v7.37,33.4 7.37,44.96 9.53,47.12 15.11,47.12 J7.6
LED
  Top 0.305: U1.9 18.09,30.4 18.58,30.9 R11.1
MISO  (via drill 0.51 pad 1.02)
  Top 0.305: J6.1 50.16,27.18 50.16,24.13 46.55,20.51 IC2.11 43.05,20.51 v42.86,20.32 | IC4.7 21.91,22.86 v24.77,25.72
  Bottom 0.305: v24.77,25.72 26.35,25.72 30.48,21.59 30.48,20.64 31.75,19.37 41.91,19.37 v42.86,20.32
MOSI
  Top 0.305: IC2.10 50.19,19.71 50.8,20.32 53.34,20.32 57.78,24.77 57.78,26.16 J6.4
N$1
  Top 0.305: IC2.17 39.37,23.88 38.55,24.7 Y1.1
N$2
  Top 0.305: J1.D- 7.45,38.43 R2.2
N$3
  Top 0.305: J1.D+ 6.38,37.78 R4.2
N$5
  Top 0.305: SPK1.1 40.64,40.06 JP4.2
N$6
  Top 0.305: LED2.A R3.2
N$7
  Top 0.305: IC4.2 21.91,12 C9.2 21.53,11.62 L2.2
N$8
  Top 0.305: IC4.3 23.18,10.86 C9.1 22.35,10.03 L1.2
N$9
  Top 0.305: LED1.A R1.2
N$10
  Top 0.305: IC2.16 40.17,23.85 40.95,24.63 Y1.3
N$11
  Top 0.305: LED4.A 20.83,29.84 20.28,30.39 R11.2
N$12
  Top 0.305: JP1.2 11.94,32.89 12.17,33.12 R7.1
N$13
  Top 0.406: J3.1 JP2.2
N$31
  Top 0.305: LED3.A R8.2
OUT1  (via drill 0.51 pad 1.02, 1.91 pad 3.81)
  Top 3.81: RLY1.3 63.5,30.48
  Bottom 3.81: RLY1.3 63.5,30.48
  other vias: 85.09,1.27 82.55,1.27 80.01,1.27 77.47,1.27 74.93,1.27 72.39,1.27 69.85,1.27 67.31,1.27 64.77,1.27 62.23,1.27 85.09,6.35 81.28,3.81 78.74,3.81 76.2,3.81 73.66,3.81 71.12,3.81 68.58,3.81 66.04,3.81 63.5,3.81 60.96,3.81 62.23,6.35 64.77,6.35 66.04,8.89 71.12,8.89 73.66,8.89 83.82,3.81 82.55,11.43 85.09,11.43 83.82,8.89 82.55,6.35 67.31,6.35 69.85,6.35 72.39,6.35 74.93,6.35 77.47,6.35 80.01,6.35 81.28,13.97 78.74,13.97 76.2,13.97 72.39,11.43 69.85,11.43 68.58,8.89 83.82,13.97 73.66,13.97 71.12,13.97 68.58,13.97 69.85,16.51 72.39,16.51 74.93,16.51 77.47,16.51 80.01,16.51 68.58,19.05 85.09,16.51 82.55,16.51 71.12,19.05 69.85,21.59 81.28,8.89 78.74,8.89 76.2,8.89 67.31,21.59 72.39,21.59 73.66,19.05 68.58,24.13 71.12,24.13 80.01,11.43 77.47,11.43 74.93,11.43 69.85,26.67 67.31,26.67 64.77,26.67 66.04,24.13 63.5,24.13 60.96,24.13 62.23,26.67 60.96,29.21 62.23,31.75 60.96,34.29 63.5,34.29 68.58,29.21 67.31,31.75 76.96,20.32
  pour Top: 59.69,-1.27 87.63,-1.27 87.63,25.72 73.66,25.72 64.77,34.61 59.69,34.61 59.69,21.59 64.77,21.59 67.31,19.05 67.31,11.43 64.77,8.89 59.69,8.89
  pour Bottom: 59.69,-2.54 88.9,-2.54 88.9,25.72 73.66,25.72 64.77,34.61 59.69,34.61 59.69,21.59 64.77,21.59 67.31,19.05 67.31,11.43 64.77,8.89 59.69,8.89
OUT2  (via drill 0.51 pad 1.02, 1.91 pad 3.81)
  Top 3.81: RLY1.4 63.5,40.64
  Bottom 3.81: RLY1.4 63.5,40.64
  other vias: 85.09,52.07 82.55,52.07 80.01,52.07 77.47,52.07 74.93,52.07 72.39,52.07 69.85,52.07 67.31,52.07 64.77,52.07 62.23,52.07 60.96,49.53 63.5,49.53 66.04,49.53 68.58,49.53 71.12,49.53 73.66,49.53 76.2,49.53 78.74,49.53 81.28,49.53 83.82,49.53 85.09,46.99 82.55,46.99 80.01,46.99 77.47,46.99 74.93,46.99 72.39,46.99 69.85,46.99 67.31,46.99 64.77,46.99 62.23,46.99 60.96,44.45 63.5,44.45 66.04,44.45 68.58,44.45 71.12,44.45 73.66,44.45 76.2,44.45 78.74,44.45 81.28,44.45 83.82,44.45 85.09,41.91 82.55,41.91 80.01,41.91 77.47,41.91 74.93,41.91 72.39,41.91 69.85,41.91 67.31,41.91 62.23,41.91 60.96,39.37 68.58,39.37 71.12,39.37 73.66,39.37 76.2,39.37 78.74,39.37 81.28,39.37 83.82,39.37 85.09,36.83 82.55,36.83 80.01,36.83 77.47,36.83 74.93,36.83 72.39,36.83 69.85,36.83 67.31,36.83 64.77,36.83 62.23,36.83 73.66,34.29 71.12,34.29 68.58,34.29 72.39,31.75 76.96,33.02
  pour Bottom: 88.9,26.99 74.3,26.99 65.41,35.88 59.69,35.88 59.69,55.88 88.9,55.88
  pour Top: 87.63,26.99 74.3,26.99 65.41,35.88 59.69,35.88 59.69,54.61 87.63,54.61
PROG
  Top 0.305: R6.2 13.14,36.54 R7.2 13.23,34.74 IC1.5
RESET  (via drill 0.51 pad 1.02)  (1 unrouted)
  Top 0.305: IC2.13 42.57,24.54 R5.1 44.13,25.4 v45.72,25.4 | SW1.4 7.79,45.87 v8.89,44.77 | U1.15 9.09,23.43 v9.53,22.99
  Bottom 0.305: J6.5 v45.72,25.4 45.72,22.54 48.26,20 48.26,11.75 44.77,8.26 24.77,8.26 22.86,6.35 | 22.86,6.35 J3.6 | 22.86,6.35 12.38,16.83 12.38,20.13 v9.53,22.99 8.89,23.62 v8.89,44.77
SCK  (via drill 0.51 pad 1.02)
  Top 0.305: J6.3 51.44,25.91 v51.44,22.86 | v51.12,19.05 50.98,18.91 IC2.9 43.36,18.91 v43.18,18.73 | IC4.5 24.45,23.5 v25.72,24.77
  Bottom 0.305: v51.44,22.86 51.44,19.37 v51.12,19.05 | v25.72,24.77 26.35,24.77 29.53,21.59 29.53,20.64 31.43,18.73 v43.18,18.73
STAT
  Top 0.305: IC1.1 19.36,34.74 20.28,33.82 R3.1
T+  (via drill 0.51 pad 1.02)
  Top 0.305: v16.32,9.84 16.51,10.03 L1.1
  Bottom 0.305: J5.2 6.55,9.84 v16.32,9.84
T-  (via drill 0.51 pad 1.02)
  Top 0.305: v14.67,10.73 15.56,11.62 L2.1
  Bottom 0.305: J5.1 14.41,10.48 v14.67,10.73
UCAP
  Top 0.406: IC2.6 46.23,16.51 46.61,16.13 C3.1
V_USB  (via drill 0.51 pad 1.02)
  Top 0.305: IC3.3 13.33,40.71 v13.02,41.02 | F1.2 10.58,42.63 9.4,43.81 R1.1
  Top 0.406: JP3.1 53.98,19.68 v52.7,18.41 51.6,17.31 IC2.7
  Top 0.508: v14.16,19.05 v14.16,25.27 | J3.4 v21.59,8.89 | IC1.4 14.57,37.37 14.4,37.54 D1.C 13.04,38.67 13.02,38.65 | F1.2 v13.02,41.02 | 13.4,42.61 IC3.1 | v13.02,41.02 13.02,42.23 13.4,42.61 | C6.1 13.04,42.96 13.4,42.61 | 13.02,38.65 v13.02,41.02 | 13.02,38.65 C1.1
  Bottom 0.406: J3.4 33.02,7.62 45.09,7.62 52.7,15.24 v52.7,18.41
  Bottom 0.508: v14.16,19.05 14.16,16.32 v21.59,8.89 | v14.16,25.27 14.16,36.01 13.02,37.15 v13.02,41.02
VBAT  (via drill 0.51 pad 1.02)
  Top 0.508: v12.76,24.19 11.11,22.54 v11.11,19.05 | IC1.3 17.18,37.37 17.25,37.44 | D1.A 17.35,37.54 17.25,37.44 | v18.99,36.07 C5.1 17.25,37.44 | v11.11,12 10.75,11.64 J2.2
  Bottom 0.508: v11.11,12 v11.11,19.05 | v18.99,36.07 17.78,34.99 17.78,25.72 16.26,24.19 v12.76,24.19
XUSB
  Top 0.406: J1.VBUS 5.64,39.08 F1.1

### Text on the board
tPlace: RST | SCL | SDA | AREF | GND | ~13 | 12 | ~11 | ~10 | ~9 | 8 | 7 | ~6 | ~5 | 4 | ~3 | 2 | 1 | 0 | TX1 | RX1 | ON | BZZR | RLY+ | 13 | 500mA | DONE | Reflowduino | botletics | BT | HM-11 | SELECT | RLY- | RED- | + | - | IOREF | RST | 3V3 | 5V | GND | GND | 3V3 | A0 | A1 | A2 | A3 | A4 | A5 | YLW / +
bPlace: Reflowduino v3 | botletics
tDocu: Designed by Timothy Woo / Released under CC-BY-SA-4.0 license | AC OUT